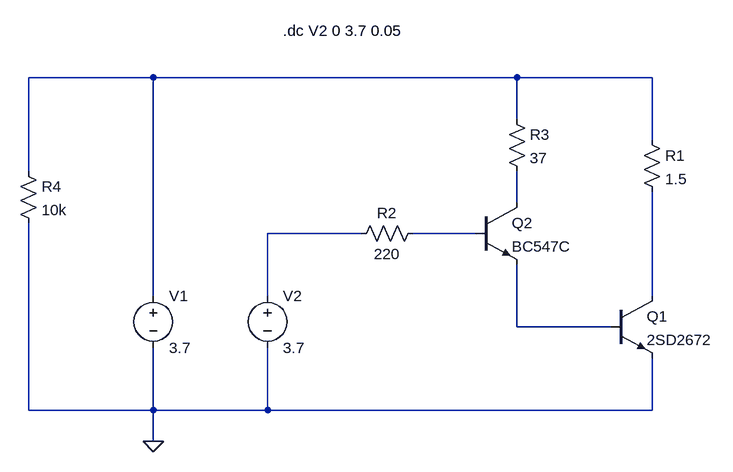
[diagram p0: schematic Draft4.asc]
Draft4.asc, the LTspice schematic file:
Version 4
SHEET 1 944 680
WIRE 48 -176 -144 -176
WIRE 608 -176 48 -176
WIRE 816 -176 608 -176
WIRE 608 -112 608 -176
WIRE 816 -80 816 -176
WIRE -144 -32 -144 -176
WIRE 608 16 608 -32
WIRE 368 64 224 64
WIRE 544 64 448 64
WIRE 48 160 48 -176
WIRE 224 160 224 64
WIRE 816 160 816 0
WIRE 608 208 608 112
WIRE 752 208 608 208
WIRE -144 336 -144 48
WIRE 48 336 48 240
WIRE 48 336 -144 336
WIRE 224 336 224 240
WIRE 224 336 48 336
WIRE 816 336 816 256
WIRE 816 336 224 336
WIRE 48 384 48 336
FLAG 48 384 0
SYMBOL voltage 48 144 R0
WINDOW 123 0 0 Left 0
WINDOW 39 0 0 Left 0
SYMATTR InstName V1
SYMATTR Value 3.7
SYMBOL voltage 224 144 R0
WINDOW 123 0 0 Left 0
WINDOW 39 0 0 Left 0
SYMATTR InstName V2
SYMATTR Value 3.7
SYMBOL npn 752 160 R0
SYMATTR InstName Q1
SYMATTR Value 2SD2672
SYMBOL res 800 -96 R0
SYMATTR InstName R1
SYMATTR Value 1.5
SYMBOL res 464 48 R90
WINDOW 0 0 56 VBottom 2
WINDOW 3 32 56 VTop 2
SYMATTR InstName R2
SYMATTR Value 220
SYMBOL npn 544 16 R0
SYMATTR InstName Q2
SYMATTR Value BC547C
SYMBOL res 592 -128 R0
SYMATTR InstName R3
SYMATTR Value 37
SYMBOL res -160 -48 R0
SYMATTR InstName R4
SYMATTR Value 10k
TEXT 248 -248 Left 2 !.dc V2 0 3.7 0.05

The netlist it stands for:
* Draft4.asc
V1 N001 0 3.7
V2 N003 0 3.7
Q1 N005 N006 0 0 2SD2672
R1 N001 N005 1.5
R2 N004 N003 220
Q2 N002 N004 N006 0 BC547C
R3 N001 N002 37
R4 N001 0 10k
.model NPN NPN
.model PNP PNP
.lib standard.bjt
.dc V2 0 3.7 0.05
.backanno
.end